# EAGLE design Ponte_Raddrizzatore (EAGLE 9.5.0)
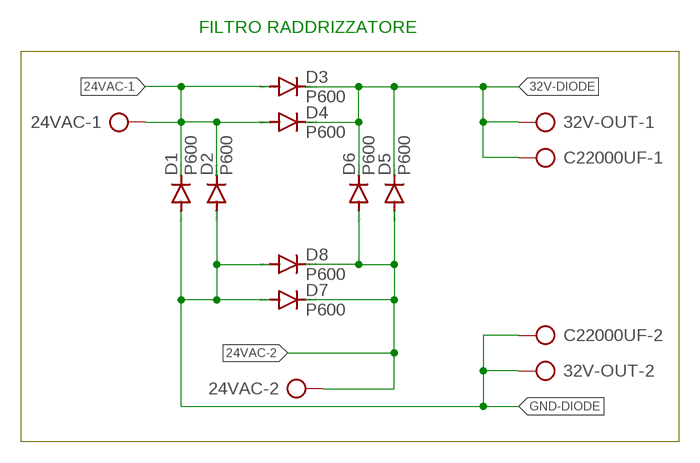
[diagram p0: schematic, sheet 1]

## Parts
24VAC  SMKDSP_1,5/2  [SMKDSP_1,5/2]
32V-OUT  SMKDSP_1,5/2  [SMKDSP_1,5/2]
C22000UF  SMKDSP_1,5/2  [SMKDSP_1,5/2]
D1  P600  [P6-15]
D2  P600  [P6-15]
D3  P600  [P6-15]
D4  P600  [P6-15]
D5  P600  [P6-15]
D6  P600  [P6-15]
D7  P600  [P6-15]
D8  P600  [P6-15]

## Nets
24VAC-1: 24VAC.1 D1.C D2.C D3.A D4.A
24VAC-2: 24VAC.2 D5.A D6.A D7.C D8.C
32V-DIODE: 32V-OUT.1 C22000UF.1 D3.C D4.C D5.C D6.C
GND-DIODE: 32V-OUT.2 C22000UF.2 D1.A D2.A D7.A D8.A

## Notes on the sheet
- FILTRO RADDRIZZATORE

## Library data of the parts
24VAC 32V-OUT C22000UF = con-phoenix-smkdsp:SMKDSP_1,5/2: Printklemme, Nennstrom: 17,5 A, Bemessungsspannung: 250 V, Raster: 5,0 mm Source: http://eshop.phoenixcontact.de .. 1733415.pdf; MF: FARNELL; MPN: 1733570; OC_FARNELL: 3041244; OC_NEWARK: 69C8588
D1-D8 = diode_MOD:P600: DIODE high voltage diode, silicon rectifier 1.0 A to 6.0 A, 50 V to 1300 V http://www.kosemi.com/product/diosr.html

## Net classes
0 default: width 0.178 mm

## Board
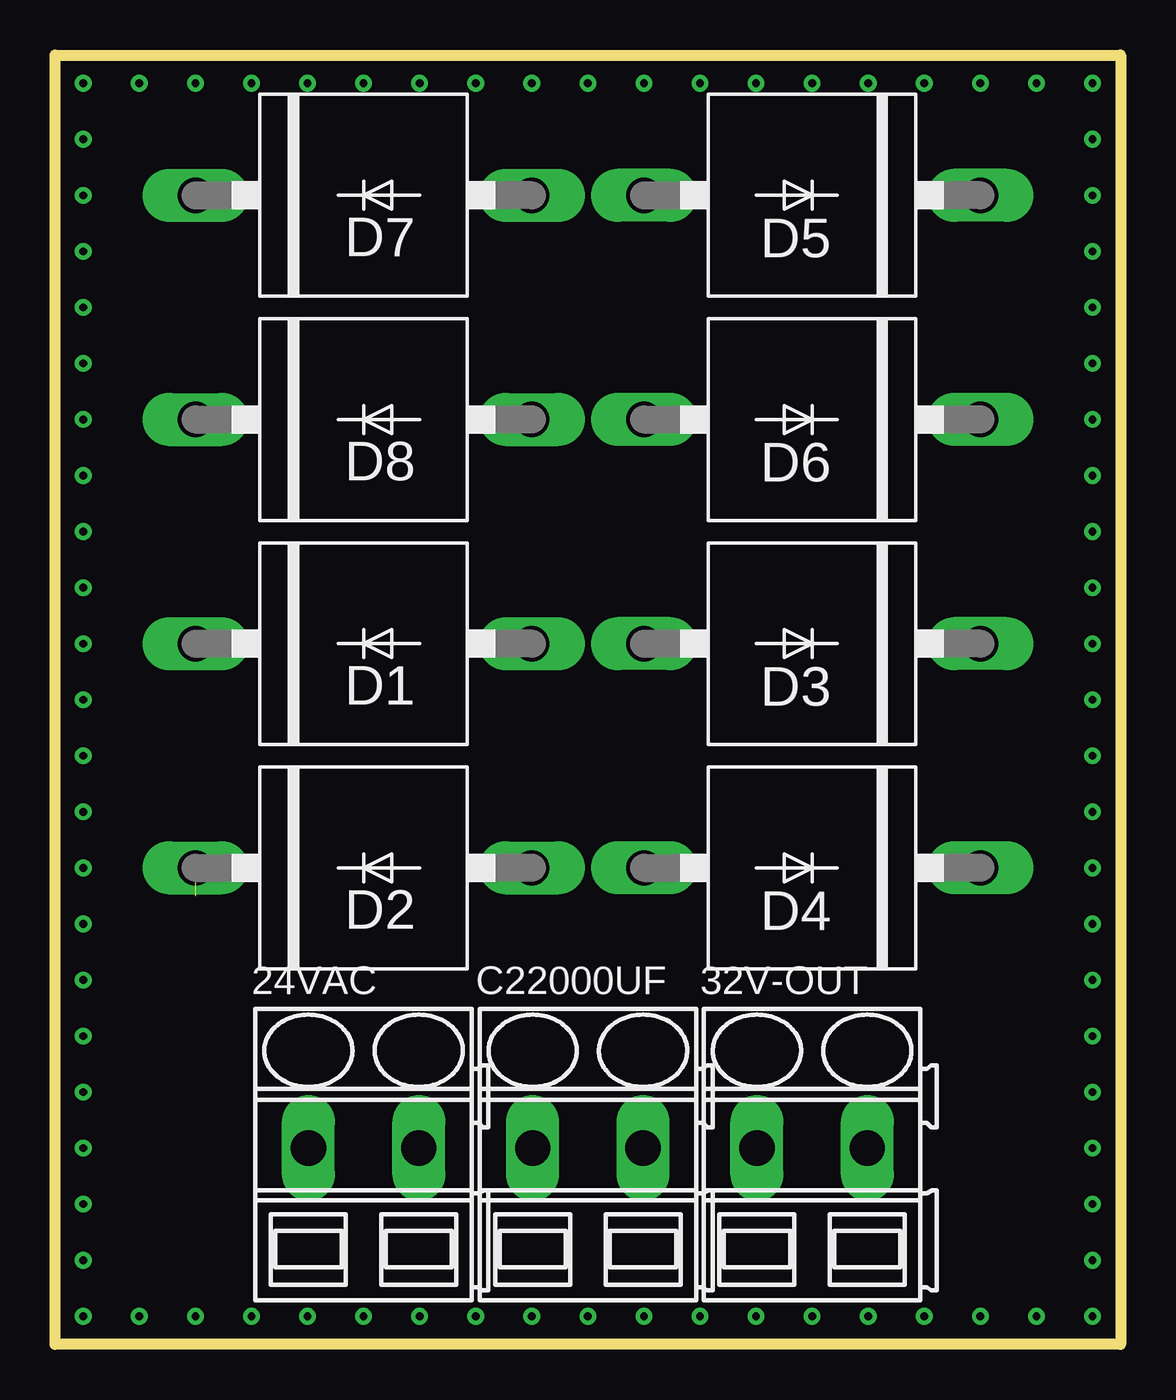
[diagram p1: board, top side]
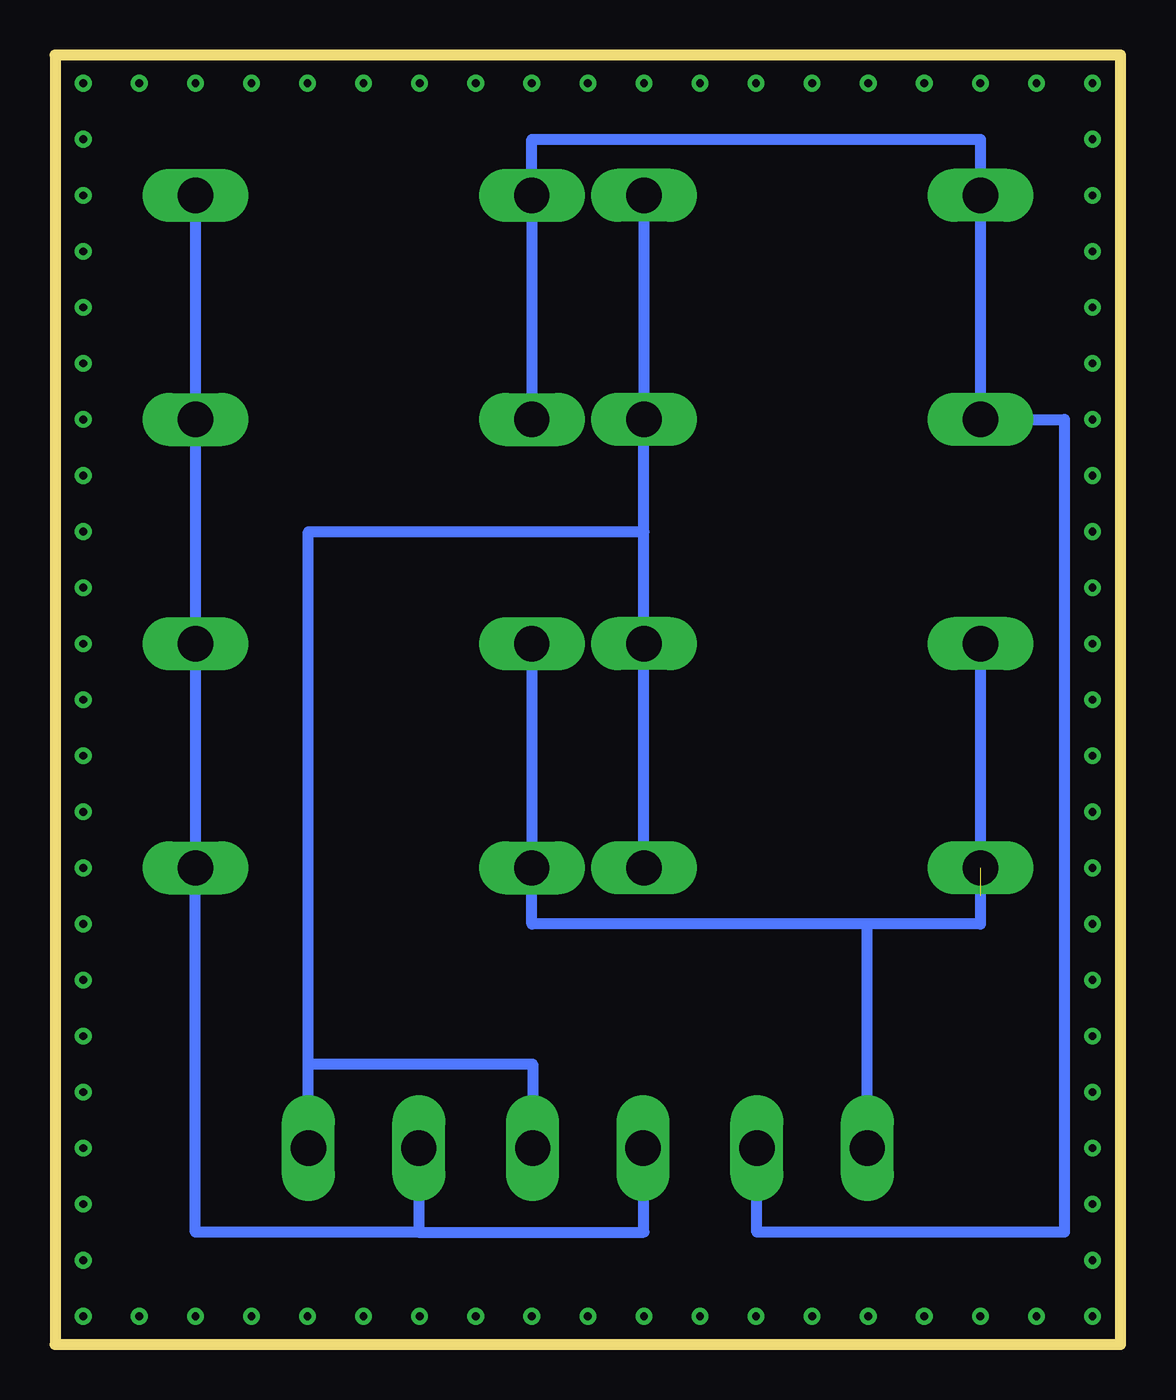
[diagram p2: board, bottom side, seen from below]

Size 48.26 x 58.42 mm. Coordinates in mm from the lower left corner, seen from the top.
Outline: 0,58.42 48.26,58.42 48.26,0 0,0 0,58.42
Copper layers (1*16): Top 0.035mm / dielectric 1.5mm / Bottom 0.035mm
Design rules "default": minimum track width 6mil, minimum drill 0.35mm, track to track 6mil, track to pad 6mil, pad to pad 6mil, via to via 6mil, smd to smd 6mil, copper to edge 40mil, drill to drill 6mil, minimum pad ring 10mil, minimum via ring 8mil, stop-mask expansion 4mil, vias tented up to drill 0mil, thermal gap 10mil

### Footprints (pad centres in the part's own frame; a part is rotated, then mirrored left to right if it is on the bottom)
SMKDSP_1,5/2 = drill 1.6 pad 1.8 long: 1 -2.5,0; 2 2.5,0
P6-15 = drill 1.6 long: A 7.62,0; C -7.62,0

### Placement (x,y rotation side)
24VAC  13.97,8.89 0 top
32V-OUT  34.29,8.89 0 top
C22000UF  24.13,8.89 0 top
D1  13.97,31.75 0 top
D2  13.97,21.59 0 top
D3  34.29,31.75 180 top
D4  34.29,21.59 180 top
D5  34.29,52.07 180 top
D6  34.29,41.91 180 top
D7  13.97,52.07 0 top
D8  13.97,41.91 0 top

### Tracks (layer width: path | path; a pad name or v marks a point on that pad's centre or on a via)
24VAC-1  (1 unrouted)
  Bottom 0.508: D1.C 6.35,20.32 | D3.A D4.A 26.67,19.05 11.47,19.05 | D2.C 6.35,19.05 11.47,19.05 | 24VAC.1 11.47,19.05
24VAC-2
  Bottom 0.508: D6.A D5.A 26.67,54.61 6.35,54.61 D7.C D8.C 2.54,41.91 2.54,5.08 16.47,5.08 24VAC.2
32V-DIODE
  Bottom 0.508: D5.C D6.C D3.C D4.C 41.91,5.08 31.79,5.08 | 32V-OUT.1 31.79,5.08 | 31.79,5.08 21.59,5.08 21.59,8.89 C22000UF.1
GND-DIODE
  Bottom 0.508: D7.A D8.A 21.59,36.83 | 21.59,36.83 D1.A D2.A | C22000UF.2 26.63,12.7 36.79,12.7 | 32V-OUT.2 36.79,12.7 | 36.79,12.7 36.79,36.83 21.59,36.83
N$2  (via drill 0.35)
  other vias: 6.35,57.15
N$3  (via drill 0.35)
  other vias: 8.89,57.15
N$4  (via drill 0.35)
  other vias: 11.43,57.15
N$5  (via drill 0.35)
  other vias: 13.97,57.15
N$6  (via drill 0.35)
  other vias: 16.51,57.15
N$7  (via drill 0.35)
  other vias: 19.05,57.15
N$8  (via drill 0.35)
  other vias: 21.59,57.15
N$9  (via drill 0.35)
  other vias: 24.13,57.15
N$10  (via drill 0.35)
  other vias: 26.67,57.15
N$11  (via drill 0.35)
  other vias: 29.21,57.15
N$12  (via drill 0.35)
  other vias: 31.75,57.15
N$13  (via drill 0.35)
  other vias: 34.29,57.15
N$14  (via drill 0.35)
  other vias: 36.83,57.15
N$15  (via drill 0.35)
  other vias: 39.37,57.15
N$16  (via drill 0.35)
  other vias: 41.91,57.15
N$17  (via drill 0.35)
  other vias: 44.45,57.15
N$19  (via drill 0.35)
  other vias: 46.99,57.15
N$20  (via drill 0.35)
  other vias: 46.99,54.61
N$21  (via drill 0.35)
  other vias: 46.99,52.07
N$22  (via drill 0.35)
  other vias: 46.99,49.53
N$23  (via drill 0.35)
  other vias: 46.99,46.99
N$24  (via drill 0.35)
  other vias: 46.99,44.45
N$25  (via drill 0.35)
  other vias: 46.99,41.91
N$26  (via drill 0.35)
  other vias: 46.99,39.37
N$27  (via drill 0.35)
  other vias: 46.99,36.83
N$28  (via drill 0.35)
  other vias: 46.99,34.29
N$29  (via drill 0.35)
  other vias: 46.99,31.75
N$30  (via drill 0.35)
  other vias: 46.99,29.21
N$31  (via drill 0.35)
  other vias: 46.99,26.67
N$32  (via drill 0.35)
  other vias: 46.99,24.13
N$33  (via drill 0.35)
  other vias: 46.99,21.59
N$34  (via drill 0.35)
  other vias: 46.99,19.05
N$35  (via drill 0.35)
  other vias: 46.99,16.51
N$36  (via drill 0.35)
  other vias: 46.99,13.97
N$37  (via drill 0.35)
  other vias: 46.99,11.43
N$38  (via drill 0.35)
  other vias: 46.99,8.89
N$39  (via drill 0.35)
  other vias: 46.99,6.35
N$40  (via drill 0.35)
  other vias: 46.99,3.81
N$41  (via drill 0.35)
  other vias: 46.99,1.27
N$43  (via drill 0.35)
  other vias: 44.45,1.27
N$44  (via drill 0.35)
  other vias: 41.91,1.27
N$45  (via drill 0.35)
  other vias: 39.37,1.27
N$46  (via drill 0.35)
  other vias: 36.83,1.27
N$47  (via drill 0.35)
  other vias: 34.29,1.27
N$48  (via drill 0.35)
  other vias: 31.75,1.27
N$49  (via drill 0.35)
  other vias: 29.21,1.27
N$50  (via drill 0.35)
  other vias: 26.67,1.27
N$51  (via drill 0.35)
  other vias: 24.13,1.27
N$52  (via drill 0.35)
  other vias: 21.59,1.27
N$53  (via drill 0.35)
  other vias: 19.05,1.27
N$54  (via drill 0.35)
  other vias: 16.51,1.27
N$55  (via drill 0.35)
  other vias: 13.97,1.27
N$56  (via drill 0.35)
  other vias: 11.43,1.27
N$57  (via drill 0.35)
  other vias: 8.89,1.27
N$58  (via drill 0.35)
  other vias: 6.35,1.27
N$59  (via drill 0.35)
  other vias: 3.81,1.27
N$60  (via drill 0.35)
  other vias: 1.27,1.27
N$61  (via drill 0.35)
  other vias: 1.27,3.81
N$62  (via drill 0.35)
  other vias: 1.27,6.35
N$63  (via drill 0.35)
  other vias: 1.27,8.89
N$64  (via drill 0.35)
  other vias: 1.27,11.43
N$65  (via drill 0.35)
  other vias: 1.27,13.97
N$66  (via drill 0.35)
  other vias: 1.27,16.51
N$67  (via drill 0.35)
  other vias: 1.27,19.05
N$68  (via drill 0.35)
  other vias: 1.27,21.59
N$69  (via drill 0.35)
  other vias: 1.27,24.13
N$70  (via drill 0.35)
  other vias: 1.27,26.67
N$71  (via drill 0.35)
  other vias: 1.27,29.21
N$72  (via drill 0.35)
  other vias: 1.27,31.75
N$73  (via drill 0.35)
  other vias: 1.27,34.29
N$74  (via drill 0.35)
  other vias: 1.27,39.37
N$76  (via drill 0.35)
  other vias: 1.27,36.83
N$79  (via drill 0.35)
  other vias: 1.27,41.91
N$80  (via drill 0.35)
  other vias: 3.81,57.15
N$82  (via drill 0.35)
  other vias: 1.27,57.15
N$83  (via drill 0.35)
  other vias: 1.27,54.61
N$84  (via drill 0.35)
  other vias: 1.27,52.07
N$85  (via drill 0.35)
  other vias: 1.27,49.53
N$86  (via drill 0.35)
  other vias: 1.27,46.99
N$87  (via drill 0.35)
  other vias: 1.27,44.45